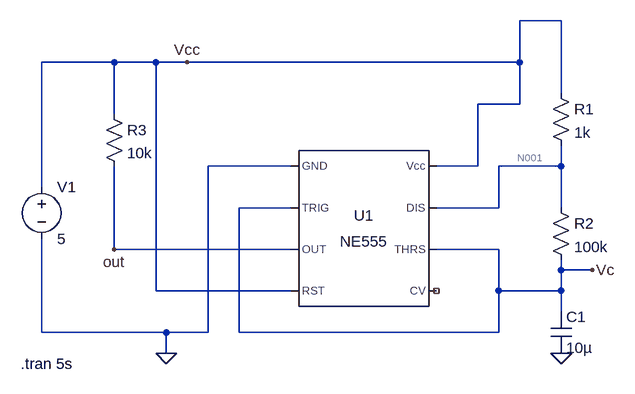
[diagram p0: schematic Draft1.asc]
Draft1.asc, the LTspice schematic file:
Version 4
SHEET 1 880 680
WIRE 496 -128 432 -128
WIRE -192 -64 -304 -64
WIRE -128 -64 -192 -64
WIRE -80 -64 -128 -64
WIRE 432 -64 432 -128
WIRE 432 -64 -80 -64
WIRE 496 -16 496 -128
WIRE 432 0 432 -64
WIRE 432 0 368 0
WIRE -192 16 -192 -64
WIRE 80 96 -48 96
WIRE 368 96 368 0
WIRE 368 96 304 96
WIRE 496 96 496 64
WIRE 496 96 400 96
WIRE -304 128 -304 -64
WIRE 80 160 0 160
WIRE 400 160 400 96
WIRE 400 160 304 160
WIRE 496 160 496 96
WIRE -192 224 -192 96
WIRE 80 224 -192 224
WIRE 400 224 304 224
WIRE 496 256 496 240
WIRE 544 256 496 256
WIRE -128 288 -128 -64
WIRE 80 288 -128 288
WIRE 400 288 400 224
WIRE 496 288 496 256
WIRE 496 288 400 288
WIRE 496 320 496 288
WIRE -304 352 -304 208
WIRE -112 352 -304 352
WIRE -48 352 -48 96
WIRE -48 352 -112 352
WIRE 0 352 0 160
WIRE 400 352 400 288
WIRE 400 352 0 352
WIRE -112 384 -112 352
FLAG -80 -64 Vcc
FLAG -192 224 out
FLAG -112 384 0
FLAG 496 384 0
FLAG 544 256 Vc
SYMBOL Misc\\NE555 192 192 R0
SYMATTR InstName U1
SYMBOL voltage -304 112 R0
SYMATTR InstName V1
SYMATTR Value 5
SYMBOL res 480 -32 R0
SYMATTR InstName R1
SYMATTR Value 1k
SYMBOL res 480 144 R0
SYMATTR InstName R2
SYMATTR Value 100k
SYMBOL cap 480 320 R0
SYMATTR InstName C1
SYMATTR Value 10µ
SYMBOL res -208 0 R0
SYMATTR InstName R3
SYMATTR Value 10k
TEXT -336 400 Left 2 !.tran 5s

The netlist it stands for:
* Draft1.asc
XU1 0 Vc out Vcc NC_01 Vc N001 Vcc NE555  ; pins GND TRIG OUT RST CV THRS DIS Vcc
V1 Vcc 0 5
R1 Vcc N001 1k
R2 N001 Vc 100k
C1 Vc 0 10µ
R3 Vcc out 10k
.tran 5s
.lib NE555.sub
.backanno
.end

* Results of the author's LTspice run, read from the files saved beside the schematic
* Operating Point, zero values left out:
*   V(vc) = 4.999 V
*   V(vcc) = 5 V
*   V(n001) = 5 V
*   V(out) = 5 V
*   I(R1) = 16.67 nA
*   I(R2) = 9.998 nA
*   I(R3) = 2.998 nA
*   I(V1) = -1.611 mA
*   Ix(u1:1) = -1.611 mA
*   Ix(u1:2) = 4.999 nA
*   Ix(u1:3) = 2.998 nA
*   Ix(u1:4) = 22.67 µA
*   Ix(u1:6) = 4.999 nA
*   Ix(u1:7) = 6.672 nA
*   Ix(u1:8) = 1.588 mA
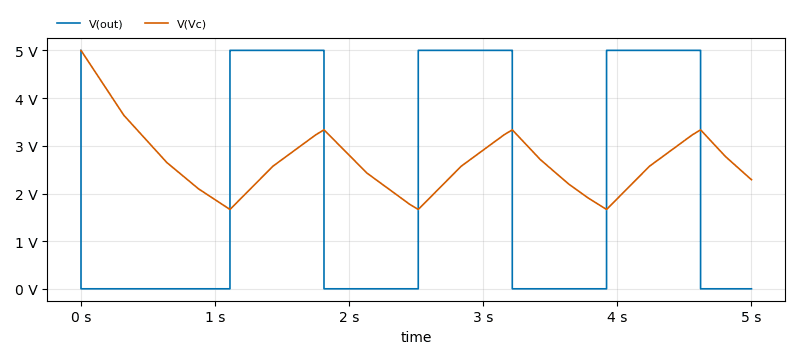
[diagram p1: Transient Analysis of Draft1.asc, plotted from the saved traces]
* Transient Analysis, 1 run:
*   V(out): min 3.028 mV, max 5 V, average 2.105 V, rms 3.243 V, last 3.028 mV
*   V(Vc): min 1.666 V, max 4.999 V, average 2.653 V, rms 2.751 V, last 2.291 V